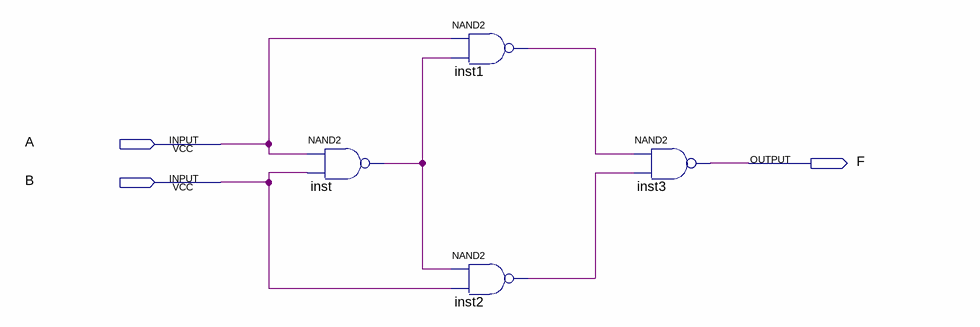
[diagram p0: schematic sheet]
// Quartus schematic q51.bdf as structural Verilog: 4 symbols, 3 pins
module q51 (
  input  A,
  input  B,
  output F
);

  wire inst1_out, inst2_out, inst_out;

  nand inst (inst_out, A, B);
  nand inst1 (inst1_out, A, inst_out);
  nand inst2 (inst2_out, inst_out, B);
  nand inst3 (F, inst1_out, inst2_out);
endmodule
